# Altium schematic sheet Ethernet.SchDoc
size A3; Author: ALP Electronics; CompanyName: ALP Electronics; DrawnBy: Caner Alp; Engineer: Caner Alp; Organization: ALP Electronics; Address2: Västerås; Address4: Sweden; SheetNumber: 9; SheetTotal: 11
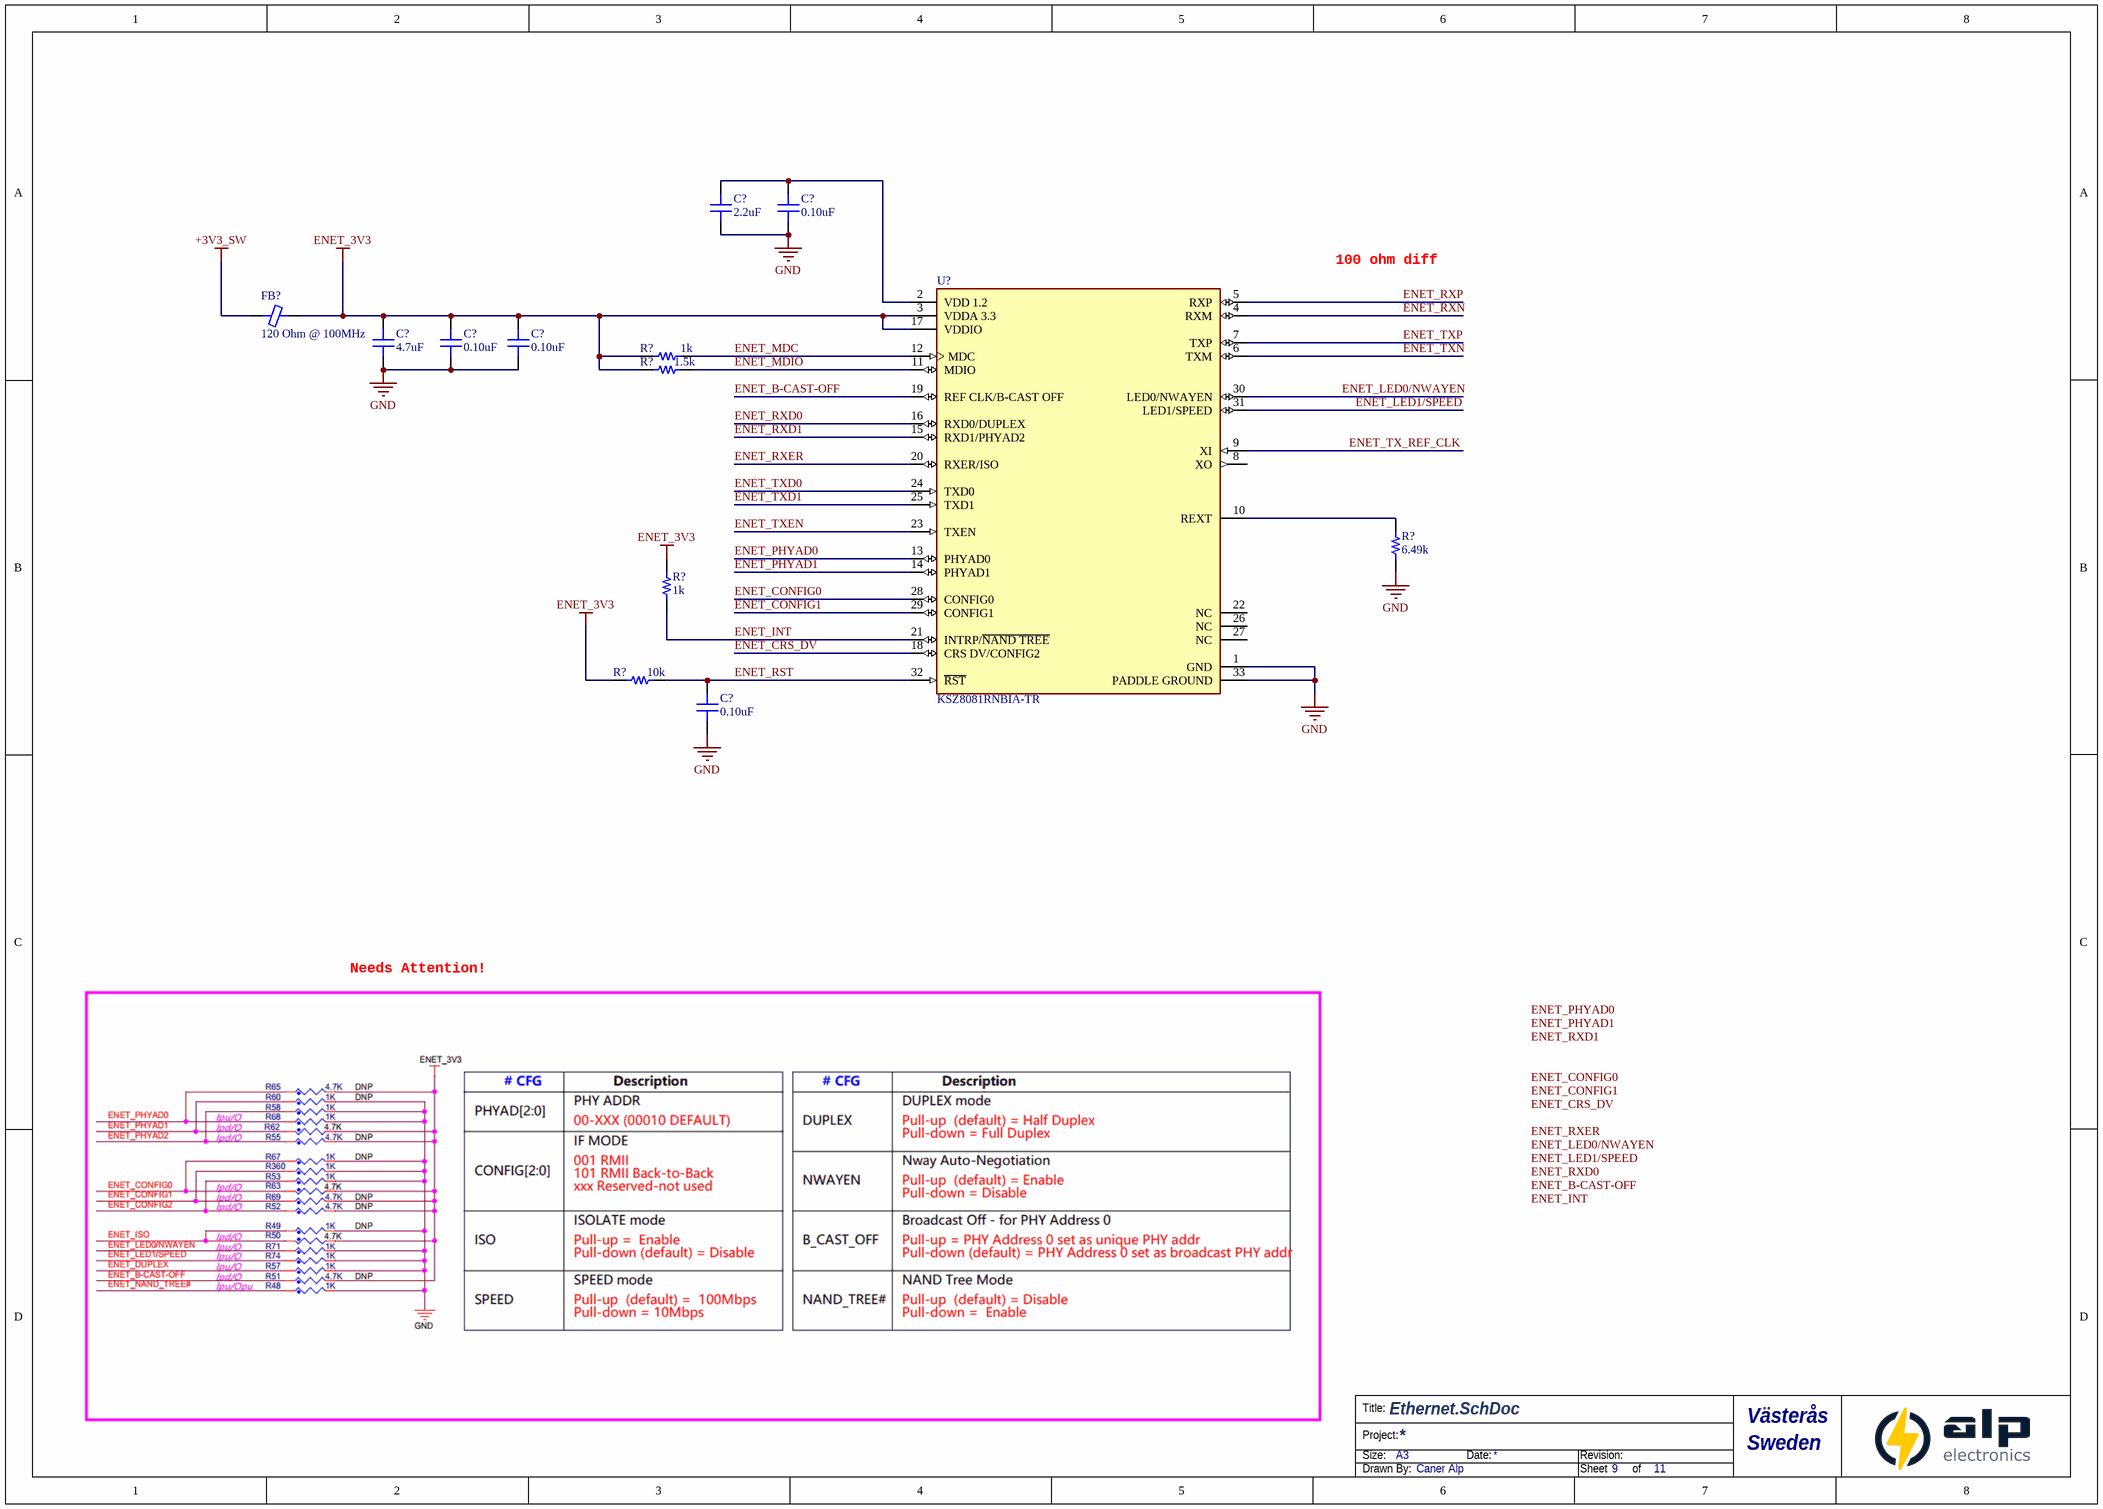
[diagram p0: Ethernet.SchDoc]

## Parts
(Parts that share a designator on the sheet are numbered #1, #2 ... from top to bottom, then left to right.)
C?#1  2.2uF  [CAP 0402/1005]
C?#2  0.10uF  [CAP 0402/1005]
C?#3  4.7uF  [CAP 0402/1005]
C?#4  0.10uF  [CAP 0402/1005]
C?#5  0.10uF  [CAP 0402/1005]
C?#6  0.10uF  [CAP 0402/1005]
FB?  120 Ohm @ 100MHz  [FER 0402/1005]
R?#1  1k  [RES 0402/1005]
R?#2  1.5k  [RES 0402/1005]
R?#3  6.49k  [RES 0402/1005]
R?#4  1k  [RES 0402/1005]
R?#5  10k  [RES 0402/1005]
U?  KSZ8081RNBIA-TR  [FP-QFN55-32LD-PL-5-MFG]

## Nets
+3V3_SW: FB?.1
ENET_3V3: C?#3.2 C?#4.2 C?#5.2 FB?.2 R?#1.2 R?#2.1 R?#4.2 R?#5.1 U?.3(VDDA_3.3) U?.17(VDDIO)
GND: C?#1.1 C?#2.1 C?#3.1 C?#4.1 C?#5.1 C?#6.1 R?#3.1 U?.1(GND) U?.33(PADDLE_GROUND)
ENET_B-CAST-OFF: U?.19(REF_CLK/B-CAST_OFF)
ENET_CONFIG0: U?.28(CONFIG0)
ENET_CONFIG1: U?.29(CONFIG1)
ENET_CRS_DV: U?.18(CRS_DV/CONFIG2)
ENET_INT: R?#4.1 U?.21(INTRP/~{NAND_TREE})
ENET_LED0/NWAYEN: U?.30(LED0/NWAYEN)
ENET_LED1/SPEED: U?.31(LED1/SPEED)
ENET_MDC: R?#1.1 U?.12(MDC)
ENET_MDIO: R?#2.2 U?.11(MDIO)
ENET_PHYAD0: U?.13(PHYAD0)
ENET_PHYAD1: U?.14(PHYAD1)
ENET_RST: C?#6.2 R?#5.2 U?.32(~{RST})
ENET_RXD0: U?.16(RXD0/DUPLEX)
ENET_RXD1: U?.15(RXD1/PHYAD2)
ENET_RXER: U?.20(RXER/ISO)
ENET_RXN: U?.4(RXM)
ENET_RXP: U?.5(RXP)
ENET_TX_REF_CLK: U?.9(XI)
ENET_TXD0: U?.24(TXD0)
ENET_TXD1: U?.25(TXD1)
ENET_TXEN: U?.23(TXEN)
ENET_TXN: U?.6(TXM)
ENET_TXP: U?.7(TXP)
NetC?#1_2: C?#1.2 C?#2.2 U?.2(VDD_1.2)
NetR?#3_2: R?#3.2 U?.10(REXT)

Not connected (* = marked no-connect by the designer): U? 8(XO) 22(NC) 26(NC) 27(NC)

## Notes on the sheet
- 100 ohm diff
- Needs Attention!
- Labels drawn without touching a wire or pin: ENET_B-CAST-OFF, ENET_CONFIG0, ENET_CONFIG1, ENET_CRS_DV, ENET_INT, ENET_LED0/NWAYEN, ENET_LED1/SPEED, ENET_PHYAD0, ENET_PHYAD1, ENET_RXD0, ENET_RXD1, ENET_RXER
- Title:
- Size:
- Project:
- A3
- Date:
- Revision:
- Drawn By:
- Sheet
- of

## Library data of the parts
C?#1 = JMK105BJ225MV-F: CAP CER 2.2UF 6.3V X5R 0402; Manufacturer: Taiyo Yuden; TemperatureRange: -55C ~ 85C; Tolerance: 20%; Value: 2.2uF; Part Number: JMK105BJ225MV-F; PartId: 12339; Supplier 1: Digi-Key; Supplier Part Number 1: 587-1453-2-ND; ComponentLink1Description: Datasheet; ComponentLink1URL: http://ds.yuden.co.jp/TYCOMPAS/ut/detail.do?productNo=JMK105BJ225MV-F&fileName=JMK105BJ225MV-F_SS&mode=specSheetDownload; ComponentLink2Description: Digi-Key Listing; ComponentLink2URL: https://www.digikey.com/product-detail/en/taiyo-yuden/JMK105BJ225MV-F/587-1453-2-ND/1004041; TemperatureCoefficient: X5R; Voltage: 6.3V; Price: 0,028; Device Package: 0402 (1005 Metric)
C?#2 C?#4-C?#6 = LMK105BJ104KV-F: CAP CER 0.1UF 10V X5R 0402; Manufacturer: Taiyo Yuden; TemperatureRange: -55C ~ 85C; Tolerance: 10%; Value: 0.10uF; Part Number: LMK105BJ104KV-F; PartId: 12322; Supplier 1: Digi-Key; Supplier Part Number 1: 587-1227-2-ND; ComponentLink1Description: Datasheet; ComponentLink1URL: http://ds.yuden.co.jp/TYCOMPAS/ut/detail.do?productNo=LMK105BJ104KV-F&fileName=LMK105BJ104KV-F_SS&mode=specSheetDownload; ComponentLink2Description: Digi-Key Listing; ComponentLink2URL: https://www.digikey.com/product-detail/en/taiyo-yuden/LMK105BJ104KV-F/587-1227-2-ND/930579; TemperatureCoefficient: X5R; Voltage: 10V; Price: 0,0021; Device Package: 0402 (1005 Metric)
C?#3 = C0402C475M9PAC7867: CAP CER 4.7UF 6.3V X5R 0402; Manufacturer: Kemet; TemperatureRange: -55C ~ 85C; Tolerance: 20%; Value: 4.7uF; Part Number: C0402C475M9PAC7867; PartId: 12865; Supplier 1: Digi-Key; Supplier Part Number 1: 399-13068-2-ND; ComponentLink1Description: Datasheet; ComponentLink1URL: http://www.kemet.com/docfinder?Partnumber=C0402C475M9PAC7867; ComponentLink2Description: Digi-Key Listing; ComponentLink2URL: https://www.digikey.com/product-detail/en/kemet/C0402C475M9PAC7867/399-13068-2-ND/5767551; TemperatureCoefficient: X5R; Voltage: 6.3V; Price: 0,063; Device Package: 0402 (1005 Metric)
FB? = CIM05U121NC: FERRITE CHIP 120 OHM 600MA 0402; Manufacturer: Samsung Electro-Mechanics America, Inc.; Type: Differential Mode - Single; DC Resistance: 250 mOhm Max; Part Number: CIM05U121NC; PartId: 6447; Value: 120 Ohm @ 100MHz; Supplier 1: Digi-Key; Supplier Part Number 1: 1276-6345-2-ND; ComponentLink1Description: Datasheet; ComponentLink1URL: http://www.samsungsem.com/kr/front/downloadcms.do?path=/kr/support/product-search/bead/__icsFiles/afieldfile/2014/11/13&fileName=S_CIM05J102NC.pdf; ComponentLink2Description: Digi-Key listing; ComponentLink2URL: http://digikey.com/product-detail/en/CIM05U121NC/1276-6345-2-ND/3973775; Price: 0,0147; Device Package: 0402 (1005 Metric); Current Rating: 600mA
R?#1 R?#4 = ERJ-2GEJ102X: RES SMD 1K OHM 5% 1/10W 0402; Manufacturer: Panasonic Electronic Components; TemperatureRange: -55C ~ 155C; TemperatureCoefficient: 200ppm/C; PowerRating: 0.1W, 1/10W; Value: 1k; Part Number: ERJ-2GEJ102X; PartId: 10982; Supplier 1: Digi-Key; Supplier Part Number 1: P1.0KJTR-ND; ComponentLink1Description: Datasheet; ComponentLink1URL: http://industrial.panasonic.com/www-cgi/jvcr13pz.cgi?E+PZ+3+AOA0001+ERJ2GEJ102X+7+WW; ComponentLink2Description: Digi-Key Listing; ComponentLink2URL: https://www.digikey.com/product-detail/en/panasonic-electronic-components/ERJ-2GEJ102X/P1.0KJTR-ND/146898; Tolerance: 5%; Price: 0,0019; Device Package: 0402 (1005 Metric)
R?#2 = ERJ-2GEJ152X: RES SMD 1.5K OHM 5% 1/10W 0402; Manufacturer: Panasonic Electronic Components; TemperatureRange: -55C ~ 155C; TemperatureCoefficient: 200ppm/C; PowerRating: 0.1W, 1/10W; Value: 1.5k; Part Number: ERJ-2GEJ152X; PartId: 10999; Supplier 1: Digi-Key; Supplier Part Number 1: P1.5KJTR-ND; ComponentLink1Description: Datasheet; ComponentLink1URL: http://industrial.panasonic.com/www-cgi/jvcr13pz.cgi?E+PZ+3+AOA0001+ERJ2GEJ152X+7+WW; ComponentLink2Description: Digi-Key Listing; ComponentLink2URL: https://www.digikey.com/product-detail/en/panasonic-electronic-components/ERJ-2GEJ152X/P1.5KJTR-ND/146914; Tolerance: 5%; Price: 0,0019; Device Package: 0402 (1005 Metric)
R?#3 = ERJ-2RKF6491X: RES SMD 6.49K OHM 1% 1/10W 0402; Manufacturer: Panasonic Electronic Components; TemperatureRange: -55C ~ 155C; TemperatureCoefficient: 100ppm/C; PowerRating: 0.1W, 1/10W; Value: 6.49k; Part Number: ERJ-2RKF6491X; PartId: 278; Supplier 1: Digi-Key; Supplier Part Number 1: P6.49KLTR-ND; ComponentLink1Description: Datasheet; ComponentLink1URL: http://industrial.panasonic.com/www-cgi/jvcr13pz.cgi?E+PZ+3+AOA0002+ERJ2RKF6491X+7+WW; ComponentLink2Description: Digikey listing; ComponentLink2URL: http://digikey.com/product-detail/en/ERJ-2RKF6491X/P6.49KLTR-ND/192423; Tolerance: 1%; Price: 0,0043; Type: Thick Film; Device Package: 0402 (1005 Metric)
R?#5 = RC0402JR-0710KL: RES SMD 10K OHM 5% 1/16W 0402; Manufacturer: Yageo; TemperatureRange: -55C ~ 155C; TemperatureCoefficient: 100ppm/C; PowerRating: 0.063W, 1/16W; Value: 10k; Part Number: RC0402JR-0710KL; PartId: 14464; Supplier 1: Digi-Key; Supplier Part Number 1: 311-10KJRTR-ND; ComponentLink1Description: Datasheet; ComponentLink1URL: http://www.yageo.com/documents/recent/PYu-RC_Group_51_RoHS_L_04.pdf; ComponentLink2Description: Digi-Key Listing; ComponentLink2URL: https://www.digikey.com/product-detail/en/yageo/RC0402JR-0710KL/311-10KJRTR-ND/726418; Tolerance: 5%; Price: 0,0017; Device Package: 0402 (1005 Metric)
U? = CMP-06281-000007-1: IC TXRX ETHERNET 32QFN; Manufacturer: Microchip; Data Rate: 100Mbits/s; Max Supply Voltage: 3.465V; Min Supply Voltage: 1.71V; Nominal Supply Current: 20-47mA; Max Junction Temp: +125°C; Simplex Duplex: Half/Full Duplex; Standoff Height: 0mm; Interface: Ethernet,Other; Number Of Channels: 1; Manufacturer Part Number: KSZ8081RNBIA-TR; Height: 1mm; ComponentLink2URL: http://ww1.microchip.com/downloads/en/DeviceDoc/00002202C.pdf; Ambient Temperature Range Low: -40°C; Digikey Description: IC TXRX ETHERNET 32QFN; Category: IC; Device Class L3: Ethernet Interface ICs; RoHS: TRUE; Temperature Range High: +125°C; Temperature: to +125°C; Package: QFN55-32LD-PL-5; Automotive: No; ComponentLink2Description: Datasheet; Device Class L1: Integrated Circuits (ICs); Octopart: https://octopart.com/ksz8081rnbia-tr-microchip-66799963; Device Class L2: Interface ICs; Lead Free: Yes; Mouser Description: Ethernet Controller, 100 Mbps, Ieee 802.3, 3.135 V, 3.465 V, Qfn, 32; Ambient Temperature Range High: +85°C